# Altium schematic sheet Microcontroller.SchDoc
size A3
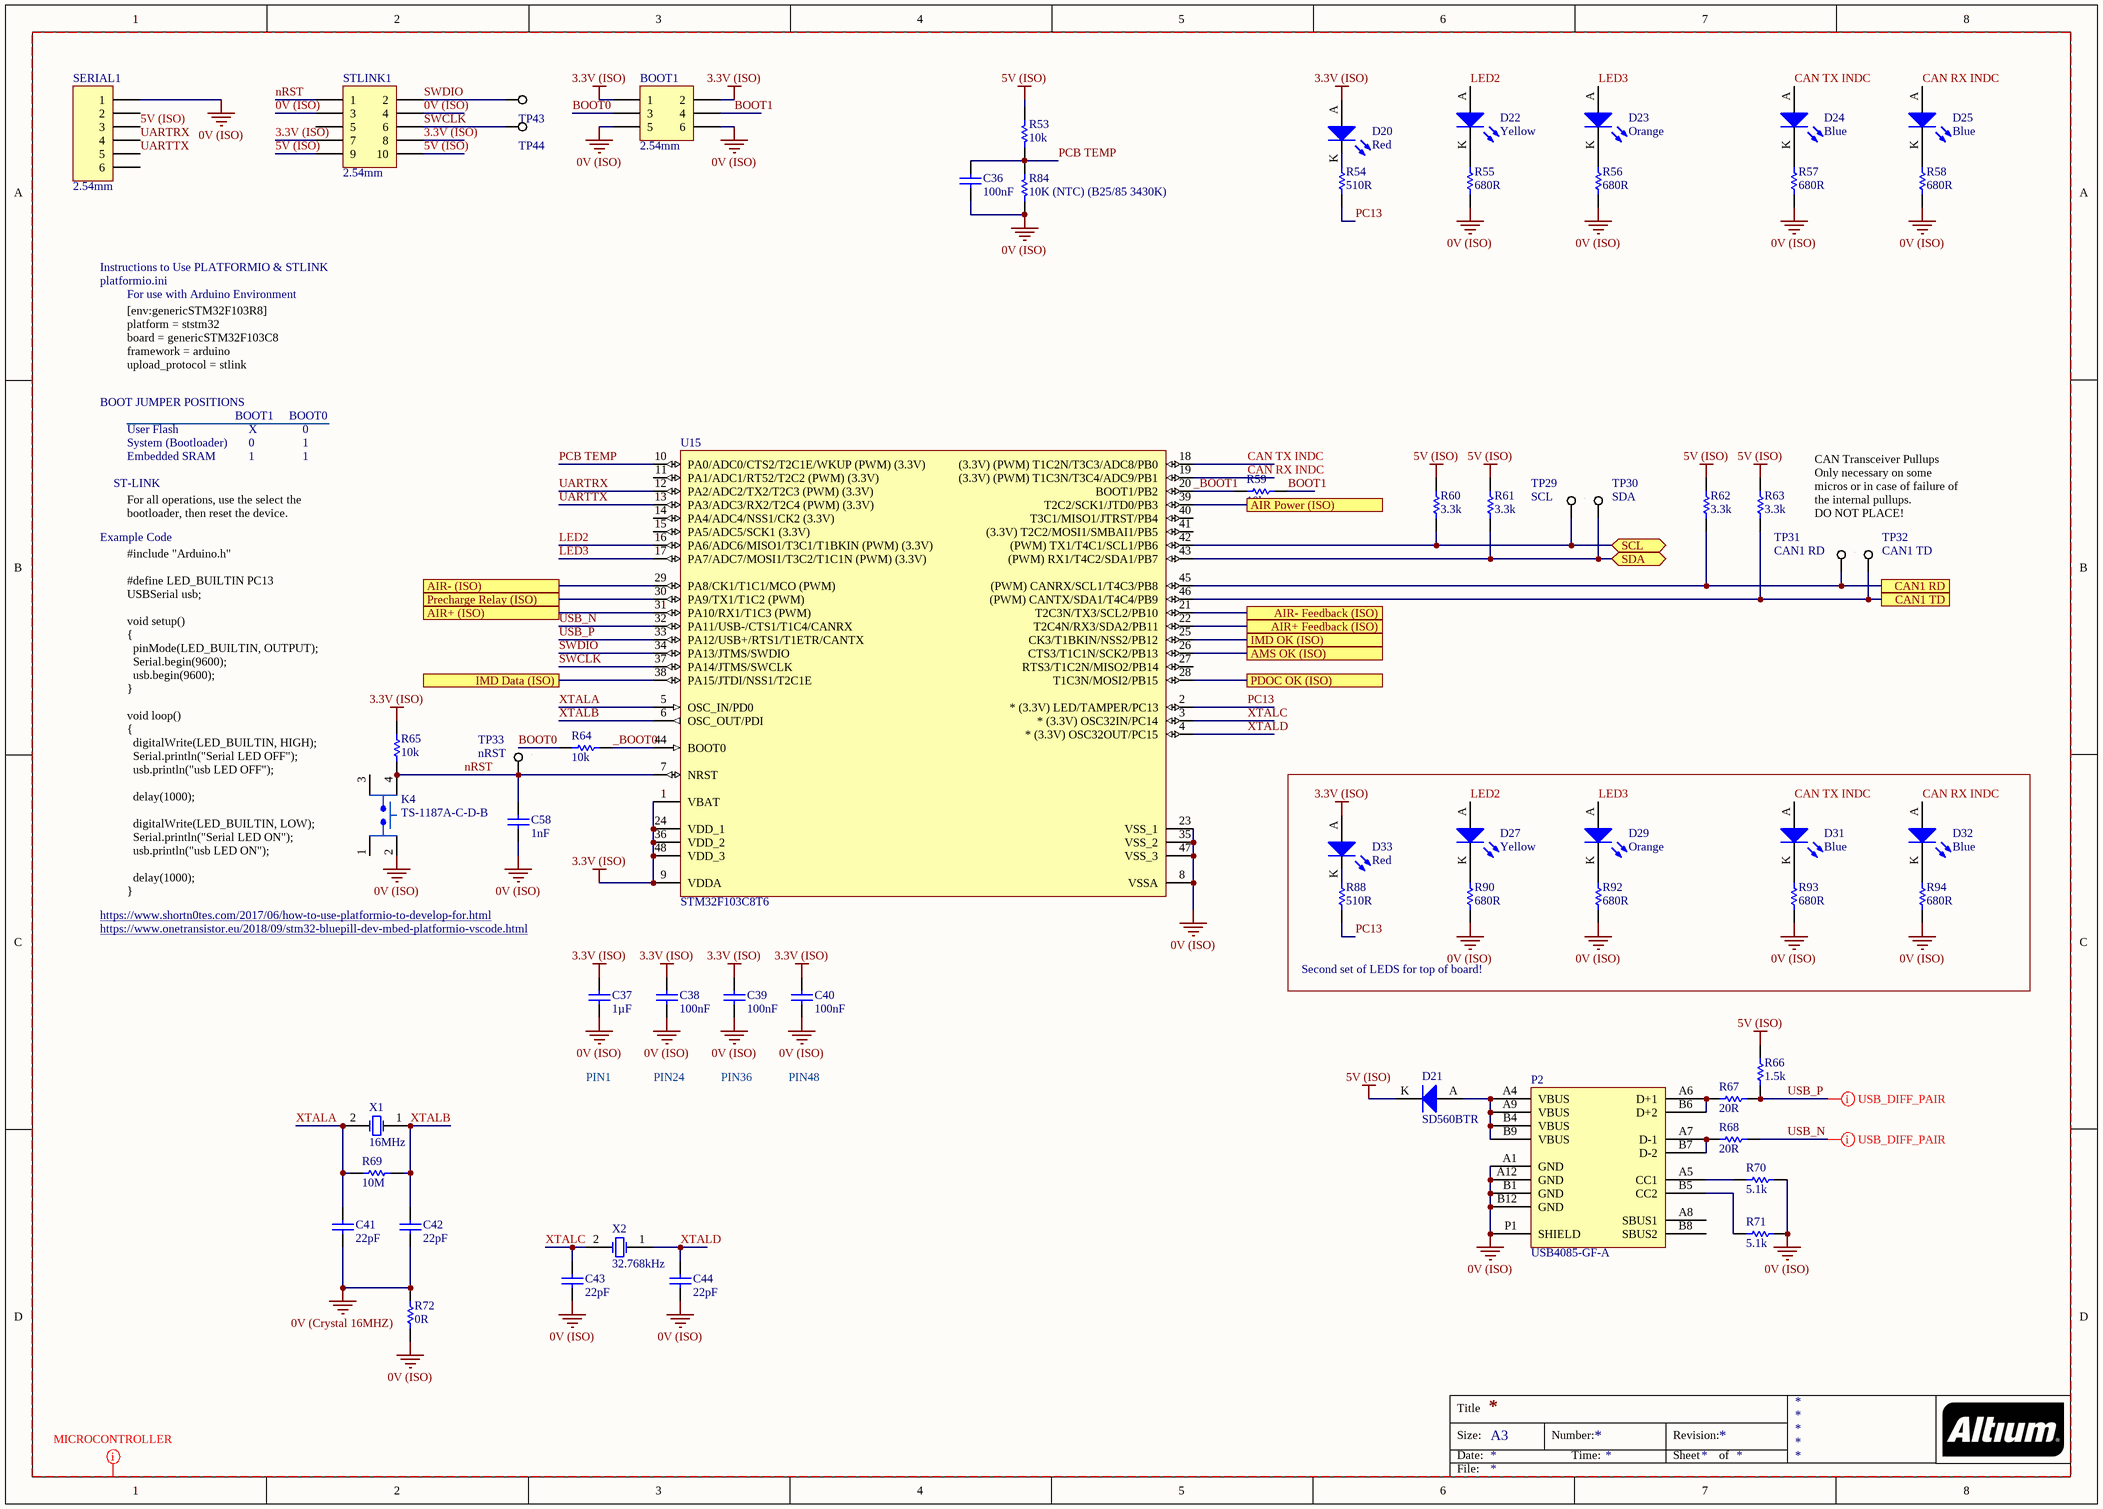
[diagram p0: Microcontroller.SchDoc]

## Parts
BOOT1  2.54mm  [TH 2.54mm Header 2x3]
C36  100nF  [0805]
C37  1µF  [0805]
C38  100nF  [0805]
C39  100nF  [0805]
C40  100nF  [0805]
C41  22pF  [0805]
C42  22pF  [0805]
C43  22pF  [0805]
C44  22pF  [0805]
C58  1nF  [0805]
D20  Red  [0805 LED]
D21  SD560BTR  [SMB Diode]
D22  Yellow  [0805 LED]
D23  Orange  [0805 LED]
D24  Blue  [0805 LED]
D25  Blue  [0805 LED]
D27  Yellow  [0805 LED]
D29  Orange  [0805 LED]
D31  Blue  [0805 LED]
D32  Blue  [0805 LED]
D33  Red  [0805 LED]
K4  TS-1187A-C-D-B  [XKB SW-4.5]
P2  USB4085-GF-A  [USB4085-GF-A]
R53  10k  [0805]
R54  510R  [0805]
R55  680R  [0805]
R56  680R  [0805]
R57  680R  [0805]
R58  680R  [0805]
R59  10k  [0805]
R60  3.3k  [0805]
R61  3.3k  [0805]
R62  3.3k  [0805]
R63  3.3k  [0805]
R64  10k  [0805]
R65  10k  [0805]
R66  1.5k  [0805]
R67  20R  [0805]
R68  20R  [0805]
R69  10M  [0805]
R70  5.1k  [0805]
R71  5.1k  [0805]
R72  0R  [0805]
R84  10K (NTC) (B25/85 3430K)  [0805]
R88  510R  [0805]
R90  680R  [0805]
R92  680R  [0805]
R93  680R  [0805]
R94  680R  [0805]
SERIAL1  2.54mm  [TH 2.54mm Header 1x6]
STLINK1  2.54mm  [TH 2.54mm Header 2x5]
TP29  SCL  [SMD Test Point 1mm]
TP30  SDA  [SMD Test Point 1mm]
TP31  CAN1 RD  [SMD Test Point 1mm]
TP32  CAN1 TD  [SMD Test Point 1mm]
TP33  nRST  [SMD Test Point 1mm]
TP43  0mm  [SMD Test Point 1mm]  (value not drawn)
TP44  0mm  [SMD Test Point 1mm]  (value not drawn)
U15  STM32F103C8T6  [STM 48-LQFP]
X1  16MHz  [Abracon HC-49/US]
X2  32.768kHz  [EPSON 2-SMD]

## Blocks framed on the sheet
Second set of LEDS for top of board!: D27 D29 D31-D33 R88 R90 R92-R94

## Ports
AIR Power (ISO), AIR+ (ISO), AIR+ Feedback (ISO), AIR- (ISO), AIR- Feedback (ISO), AMS OK (ISO), CAN1 RD, CAN1 TD, IMD Data (ISO), IMD OK (ISO), PDOC OK (ISO), Precharge Relay (ISO), SCL (bidir), SDA (bidir)

## Nets
0V (Crystal 16MHZ): C41.1 C42.1 R72.2
0V (ISO): BOOT1.5 BOOT1.6 C36.1 C37.1 C38.1 C39.1 C40.1 C43.1 C44.1 C58.1 K4.2(VDD) P2.A1(GND) P2.A12(GND) P2.B1(GND) P2.B12(GND) P2.P1(SHIELD) R55.1 R56.1 R57.1 R58.1 R70.2 R71.2 R72.1 R84.1 R90.1 R92.1 R93.1 R94.1 SERIAL1.1 STLINK1.3 STLINK1.4 U15.8(VSSA) U15.23(VSS_1) U15.35(VSS_2) U15.47(VSS_3)
3.3V (ISO): BOOT1.1 BOOT1.2 C37.2 C38.2 C39.2 C40.2 D20.A D33.A R65.2 STLINK1.7 STLINK1.8 U15.1(VBAT) U15.9(VDDA) U15.24(VDD_1) U15.36(VDD_2) U15.48(VDD_3)
5V (ISO): D21.K R53.2 R60.2 R61.2 R62.2 R63.2 R66.2 SERIAL1.3 STLINK1.9 STLINK1.10
_BOOT0: R64.2 U15.44(BOOT0)
_BOOT1: R59.1 U15.20(BOOT1/PB2)
AIR Power (ISO): U15.39(T2C2/SCK1/JTD0/PB3) ; port AIR Power (ISO)
AIR+ (ISO): U15.31(PA10/RX1/T1C3_(PWM)) ; port AIR+ (ISO)
AIR+ Feedback (ISO): U15.22(T2C4N/RX3/SDA2/PB11) ; port AIR+ Feedback (ISO)
AIR- (ISO): U15.29(PA8/CK1/T1C1/MCO_(PWM)) ; port AIR- (ISO)
AIR- Feedback (ISO): U15.21(T2C3N/TX3/SCL2/PB10) ; port AIR- Feedback (ISO)
AMS OK (ISO): U15.26(CTS3/T1C1N/SCK2/PB13) ; port AMS OK (ISO)
BOOT0: BOOT1.3 R64.1
BOOT1: BOOT1.4 R59.2
CAN1 RD: R62.1 TP31.1 U15.45((PWM)_CANRX/SCL1/T4C3/PB8) ; port CAN1 RD
CAN1 TD: R63.1 TP32.1 U15.46((PWM)_CANTX/SDA1/T4C4/PB9) ; port CAN1 TD
CAN RX INDC: D25.A D32.A U15.19((3.3V)_(PWM)_T1C3N/T3C4/ADC9/PB1)
CAN TX INDC: D24.A D31.A U15.18((3.3V)_(PWM)_T1C2N/T3C3/ADC8/PB0)
IMD Data (ISO): U15.38(PA15/JTDI/NSS1/T2C1E) ; port IMD Data (ISO)
IMD OK (ISO): U15.25(CK3/T1BKIN/NSS2/PB12) ; port IMD OK (ISO)
LED2: D22.A D27.A U15.16(PA6/ADC6/MISO1/T3C1/T1BKIN_(PWM)_(3.3V))
LED3: D23.A D29.A U15.17(PA7/ADC7/MOSI1/T3C2/T1C1N_(PWM)_(3.3V))
nRST: C58.2 K4.4(VDD) R65.1 STLINK1.1 TP33.1 U15.7(NRST)
PC13: R54.1 R88.1 U15.2(*_(3.3V)_LED/TAMPER/PC13)
PCB TEMP: C36.2 R53.1 R84.2 U15.10(PA0/ADC0/CTS2/T2C1E/WKUP_(PWM)_(3.3V))
PDOC OK (ISO): U15.28(T1C3N/MOSI2/PB15) ; port PDOC OK (ISO)
Precharge Relay (ISO): U15.30(PA9/TX1/T1C2_(PWM)) ; port Precharge Relay (ISO)
SCL: R60.1 TP29.1 U15.42((PWM)_TX1/T4C1/SCL1/PB6) ; port SCL
SDA: R61.1 TP30.1 U15.43((PWM)_RX1/T4C2/SDA1/PB7) ; port SDA
SWCLK: STLINK1.6 TP44.1 U15.37(PA14/JTMS/SWCLK)
SWDIO: STLINK1.2 TP43.1 U15.34(PA13/JTMS/SWDIO)
UARTRX: SERIAL1.4 U15.12(PA2/ADC2/TX2/T2C3_(PWM)_(3.3V))
UARTTX: SERIAL1.5 U15.13(PA3/ADC3/RX2/T2C4_(PWM)_(3.3V))
USB_N: R68.2 U15.32(PA11/USB-/CTS1/T1C4/CANRX)
USB_P: R66.1 R67.2 U15.33(PA12/USB+/RTS1/T1ETR/CANTX)
XTALA: C41.2 R69.2 U15.5(OSC_IN/PD0) X1.2(OSC2)
XTALB: C42.2 R69.1 U15.6(OSC_OUT/PDI) X1.1(OSC1)
XTALC: C43.2 U15.3(*_(3.3V)_OSC32IN/PC14) X2.2(OSC2)
XTALD: C44.2 U15.4(*_(3.3V)_OSC32OUT/PC15) X2.1(OSC1)
NetD20_K: D20.K R54.2
NetD21_A: D21.A P2.A4(VBUS) P2.A9(VBUS) P2.B4(VBUS) P2.B9(VBUS)
NetD22_K: D22.K R55.2
NetD23_K: D23.K R56.2
NetD24_K: D24.K R57.2
NetD25_K: D25.K R58.2
NetD27_K: D27.K R90.2
NetD29_K: D29.K R92.2
NetD31_K: D31.K R93.2
NetD32_K: D32.K R94.2
NetD33_K: D33.K R88.2
NetP2_A5: P2.A5(CC1) R70.1
NetP2_A6: P2.A6(D+1) P2.B6(D+2) R67.1
NetP2_A7: P2.A7(D-1) P2.B7(D-2) R68.1
NetP2_B5: P2.B5(CC2) R71.1

Not connected (* = marked no-connect by the designer): K4 1(VDD) 3(VDD); P2 A8(SBUS1) B8(SBUS2); SERIAL1 2 6; STLINK1 5; U15 11(PA1/ADC1/RT52/T2C2_(PWM)_(3.3V)) 14(PA4/ADC4/NSS1/CK2_(3.3V)) 15(PA5/ADC5/SCK1_(3.3V)) 27(RTS3/T1C2N/MISO2/PB14) 40(T3C1/MISO1/JTRST/PB4) 41((3.3V)_T2C2/MOSI1/SMBAI1/PB5)

## Layout directives
net class MICROCONTROLLER: 0V (Crystal 16MHZ), 0V (ISO), 3.3V (ISO), 5V (ISO), _BOOT0, _BOOT1, BOOT0, BOOT1, CAN RX INDC, CAN TX INDC, LED2, LED3, nRST, PC13, PCB TEMP, SWCLK, SWDIO, UARTRX, UARTTX, USB_N, USB_P, XTALA, XTALB, XTALC, XTALD
differential pair; differential pair class USB_DIFF_PAIR: USB_N, USB_P

## Notes on the sheet
- Instructions to Use PLATFORMIO & STLINK
- platformio.ini
- For use with Arduino Environment
- BOOT JUMPER POSITIONS
- [env:genericSTM32F103R8]
  platform = ststm32
  board = genericSTM32F103C8
  framework = arduino
  upload_protocol = stlink
- User Flash
- System (Bootloader)
- BOOT1
- X
- 0
- BOOT0
- 1
- ST-LINK
- Embedded SRAM
- For all operations, use the select the bootloader, then reset the device.
- CAN Transceiver Pullups
  Only necessary on some micros or in case of failure of the internal pullups.
  DO NOT PLACE!
- Example Code
- https://www.shortn0tes.com/2017/06/how-to-use-platformio-to-develop-for.html
- (near K4) #include "Arduino.h"
  #define LED_BUILTIN PC13
  USBSerial usb;
  void setup()
  {
  pinMode(LED_BUILTIN, OUTPUT);
  Serial.begin(9600);
  usb.begin(9600);
  }
  void loop()
  {
  digitalWrite(LED_BUILTIN, HIGH);
  Serial.println("Serial LED OFF");
  usb.println("usb LED OFF");
  delay(1000);
  digitalWrite(LED_BUILTIN, LOW);
  Serial.println("Serial LED ON");
  usb.println("usb LED ON");
  delay(1000);
  }
- https://www.onetransistor.eu/2018/09/stm32-bluepill-dev-mbed-platformio-vscode.html
- PIN1
- PIN24
- PIN36
- PIN48
- Title
- Size:
- Date:
- A3
- Number:
- Time:
- Revision:
- Sheet
- of
- File:

## Library data of the parts
BOOT1 = TH 2.54mm Header 2x3: Positions: 6; Angle: 0; Flange: No; Contact: NA; Part Number: TH 2.54mm Header 2x3; Pitch: 2.54mm; Row Spacing: 2.54mm
C36 = GCM21BR71E104KA37L: Manufacturer: muRata; Tolerance: 10%; Material: X7R; Rated Voltage: 25V; Part Number: GCM21BR71E104KA37L; Value: 100nF; Digikey Part Number: DO NOT USE FOR NEW DESIGNS
C37 = GCM21BR71H105KA03L: Manufacturer: muRata; Tolerance: ±10%; Material: X7R; Rated Voltage: 50V; Part Number: GCM21BR71H105KA03L; Value: 1µF; Digikey Part Number: 490-10675-1-ND
C38-C40 = GCM21BR71H104KA37L: Manufacturer: muRata; Tolerance: ±10%; Material: X7R; Rated Voltage: 50V; Part Number: GCM21BR71H104KA37L; Value: 100nF; Digikey Part Number: 490-6064-1-ND
C41-C44 = GRM21A5C2E220JW01D: Manufacturer: muRata; Tolerance: ±5%; Material: C0G, NP0; Rated Voltage: 250V; Part Number: GRM21A5C2E220JW01D; Value: 22pF; Digikey Part Number: 490-5534-1-ND
C58 = GCM21BR71H102KA37L: Manufacturer: muRata; Tolerance: 10%; Material: X7R; Rated Voltage: 50V; Part Number: GCM21BR71H102KA37L; Value: 1nF; Digikey Part Number: DO NOT USE FOR NEW DESIGNS
D20 D33 = SML-210LTT86: Red LED Indication - Discrete 1.75V 0805 (2012 Metric); Manufacturer: ROHM Semiconductor; Part Number: SML-210LTT86; Colour: Red; Digikey Part Number: 511-1286-1-ND; Digikey Link: https://www.digikey.com/product-detail/en/rohm-semiconductor/SML-210LTT86/511-1286-1-ND/637099
D21 = SD560BTR: 1.2V_F 600V 5A SMB; Manufacturer: SMC Diode Solutions; Part Number: SD560BTR; Digikey Part Number: 1655-1530-2-ND; Digikey Link: https://www.digikey.com/product-detail/en/smc-diode-solutions/SD560BTR/1655-1530-2-ND/6022620
D22 D27 = SML-211YTT86: Yellow LED Indication - Discrete 1.75V 0805 (2012 Metric); Manufacturer: ROHM Semiconductor; Part Number: SML-211YTT86; Colour: Yellow; Digikey Part Number: 511-1293-1-ND; Digikey Link: https://www.digikey.com/product-detail/en/rohm-semiconductor/SML-211YTT86/511-1293-1-ND/637106
D23 D29 = SML-211DTT86: Orange LED Indication - Discrete 1.75V 0805 (2012 Metric); Manufacturer: ROHM Semiconductor; Part Number: SML-211DTT86; Colour: Orange; Digikey Part Number: 511-1291-1-ND; Digikey Link: https://www.digikey.com/product-detail/en/rohm-semiconductor/SML-211DTT86/511-1291-1-ND/637104
D24 D25 D31 D32 = SML-MN2BCTT86C: LED BLUE CLEAR 2012 SMD; Manufacturer: ROHM Semiconductor; Part Number: SML-MN2BCTT86C; Colour: Blue; Digikey Part Number: 846-1207-1-ND; Digikey Link: https://www.digikey.com/product-detail/en/rohm-semiconductor/SMLMN2BCTT86C/846-1207-1-ND/6057239
K4 = TS-1187A-C-D-B: TACTILE SWITCHES SPST 5.10MM X 5.10MM 0.80MM SMD ROHS; Manufacturer: XKB Enerprise; Part Number: TS-1187A-C-D-B; Link: https://jlcpcb.com/client/index.html#/parts/componentSearch?searchTxt=usb
P2 = USB4085-GF-A: USB - C (Type - C) USB 2.0 Receptacle Connector 16 Position Through Hole, Right Angle; Angle: 90; Part Number: USB4085-GF-A; Digikey Part Number: 2073-USB4085-GF-ACT-ND; Digikey Link: https://www.digikey.ee/product-detail/en/gct/USB4085-GF-A/2073-USB4085-GF-ACT-ND/9859733
R53 R59 R64 R65 = RC0805FR0710KL: Manufacturer: YAGEO; Tolerance: 0.01; Rated Voltage: 0.125W; Part Number: RC0805FR0710KL; Value: 10k; Material: FR-07; Digikey Part Number: 311-10.0KCRCT-ND
R54 R88 = RC0805FR07510RL: Manufacturer: YAGEO; Tolerance: 0.01; Rated Voltage: 0.125W; Part Number: RC0805FR07510RL; Value: 510R; Material: FR-07; Digikey Part Number: 311-510CRCT-ND
R55-R58 R90 R92-R94 = RC0805FR07680RL: Manufacturer: YAGEO; Tolerance: 0.01; Rated Voltage: 0.125W; Part Number: RC0805FR07680RL; Value: 680R; Material: FR-07; Digikey Part Number: 311-680CRCT-ND
R60-R63 = RC0805FR073K3L: Manufacturer: YAGEO; Tolerance: 0.01; Rated Voltage: 0.125W; Part Number: RC0805FR073K3L; Value: 3.3k; Material: FR-07; Digikey Part Number: 311-3.30KCRCT-ND
R66 = RC0805FR071K5L: Manufacturer: YAGEO; Tolerance: 0.01; Rated Voltage: 0.125W; Part Number: RC0805FR071K5L; Value: 1.5k; Material: FR-07; Digikey Part Number: 311-1.50KCRCT-ND
R67 R68 = RC0805FR0720RL: Manufacturer: YAGEO; Tolerance: 0.01; Rated Voltage: 0.125W; Part Number: RC0805FR0720RL; Value: 20R; Material: FR-07; Digikey Part Number: 311-20.0CRCT-ND
R69 = RC0805FR0710ML: Manufacturer: YAGEO; Tolerance: 0.01; Rated Voltage: 0.125W; Part Number: RC0805FR0710ML; Value: 10M; Material: FR-07; Digikey Part Number: 311-10.0MCRCT-ND
R70 R71 = RC0805FR075K1L: Manufacturer: YAGEO; Tolerance: 0.01; Rated Voltage: 0.125W; Part Number: RC0805FR075K1L; Value: 5.1k; Material: FR-07; Digikey Part Number: 311-5.10KCRCT-ND
R72 = RC0805FR070RL: Manufacturer: YAGEO; Tolerance: 0.01; Rated Voltage: 0.125W; Part Number: RC0805FR070RL; Value: 0R; Material: FR-07; Digikey Part Number: 311-0.0CRCT-ND
R84 = NTCS0805E3103FLT: Manufacturer: Vishay Beyschlag; Tolerance: 0.01; Rated Voltage: 210mW; Part Number: NTCS0805E3103FLT; Value: 10K (NTC) (B25/85 3430K); Digikey Part Number: BC2733CT-ND
SERIAL1 = TH 2.54mm Header 1x6: Positions: 6; Angle: 0; Flange: No; Contact: NA; Part Number: TH 2.54mm Header 1x6; Pitch: 2.54mm; Row Spacing: 2.54mm
STLINK1 = TH 2.54mm Header 2x5: Positions: 10; Angle: 0; Flange: No; Contact: NA; Part Number: TH 2.54mm Header 2x5; Pitch: 2.54mm; Row Spacing: 2.54mm
TP29-TP33 = SMD Test Point Small: Positions: 1; Pitch: 0mm; Row Spacing: 0; Flange: No; Contact: NA; Part Number: SMD Test Point Small; Angle: 0
TP43 TP44 = SMD Test Point Small: Positions: 1; Row Spacing: 0; Flange: No; Contact: NA; Part Number: SMD Test Point Small; Pitch: 0mm; Angle: 0
U15 = STM32F103C8T6: ARM® Cortex®-M3 STM32F1 Microcontroller IC 32-Bit 72MHz 64KB (64K x 8) FLASH; Manufacturer: STMicroelectronics; Part Number: STM32F103C8T6; Digikey Part Number: 497-6063-ND; Digikey Link: https://www.digikey.com/product-detail/en/stmicroelectronics/STM32F103C8T6/497-6063-ND/1646338
X1 = ABLS-16.000MHZ-B4-T: Manufacturer: Abracon LLC; Load Capacitance: 18pF; ESR: 40R; Part Number: ABLS-16.000MHZ-B4-T; Digikey Part Number: 535-10226-1-ND; Digikey Link: https://www.digikey.com/product-detail/en/abracon-llc/ABLS-16.000MHZ-B4-T/535-10226-1-ND/2184261; Value: 16MHz
X2 = FC-135 32.7680KA-A5: Manufacturer: EPSON; Load Capacitance: 12.5pF; ESR: 70k; Part Number: FC-135 32.7680KA-A5; Value: 32.768kHz; Digikey Part Number: SER4103TR-ND; Digikey Link: https://www.digikey.com/product-detail/en/epson/FC-135-32.7680KA-A5/SER4103TR-ND/5259895